# EAGLE schematic electronic system (EAGLE 9.2.2)
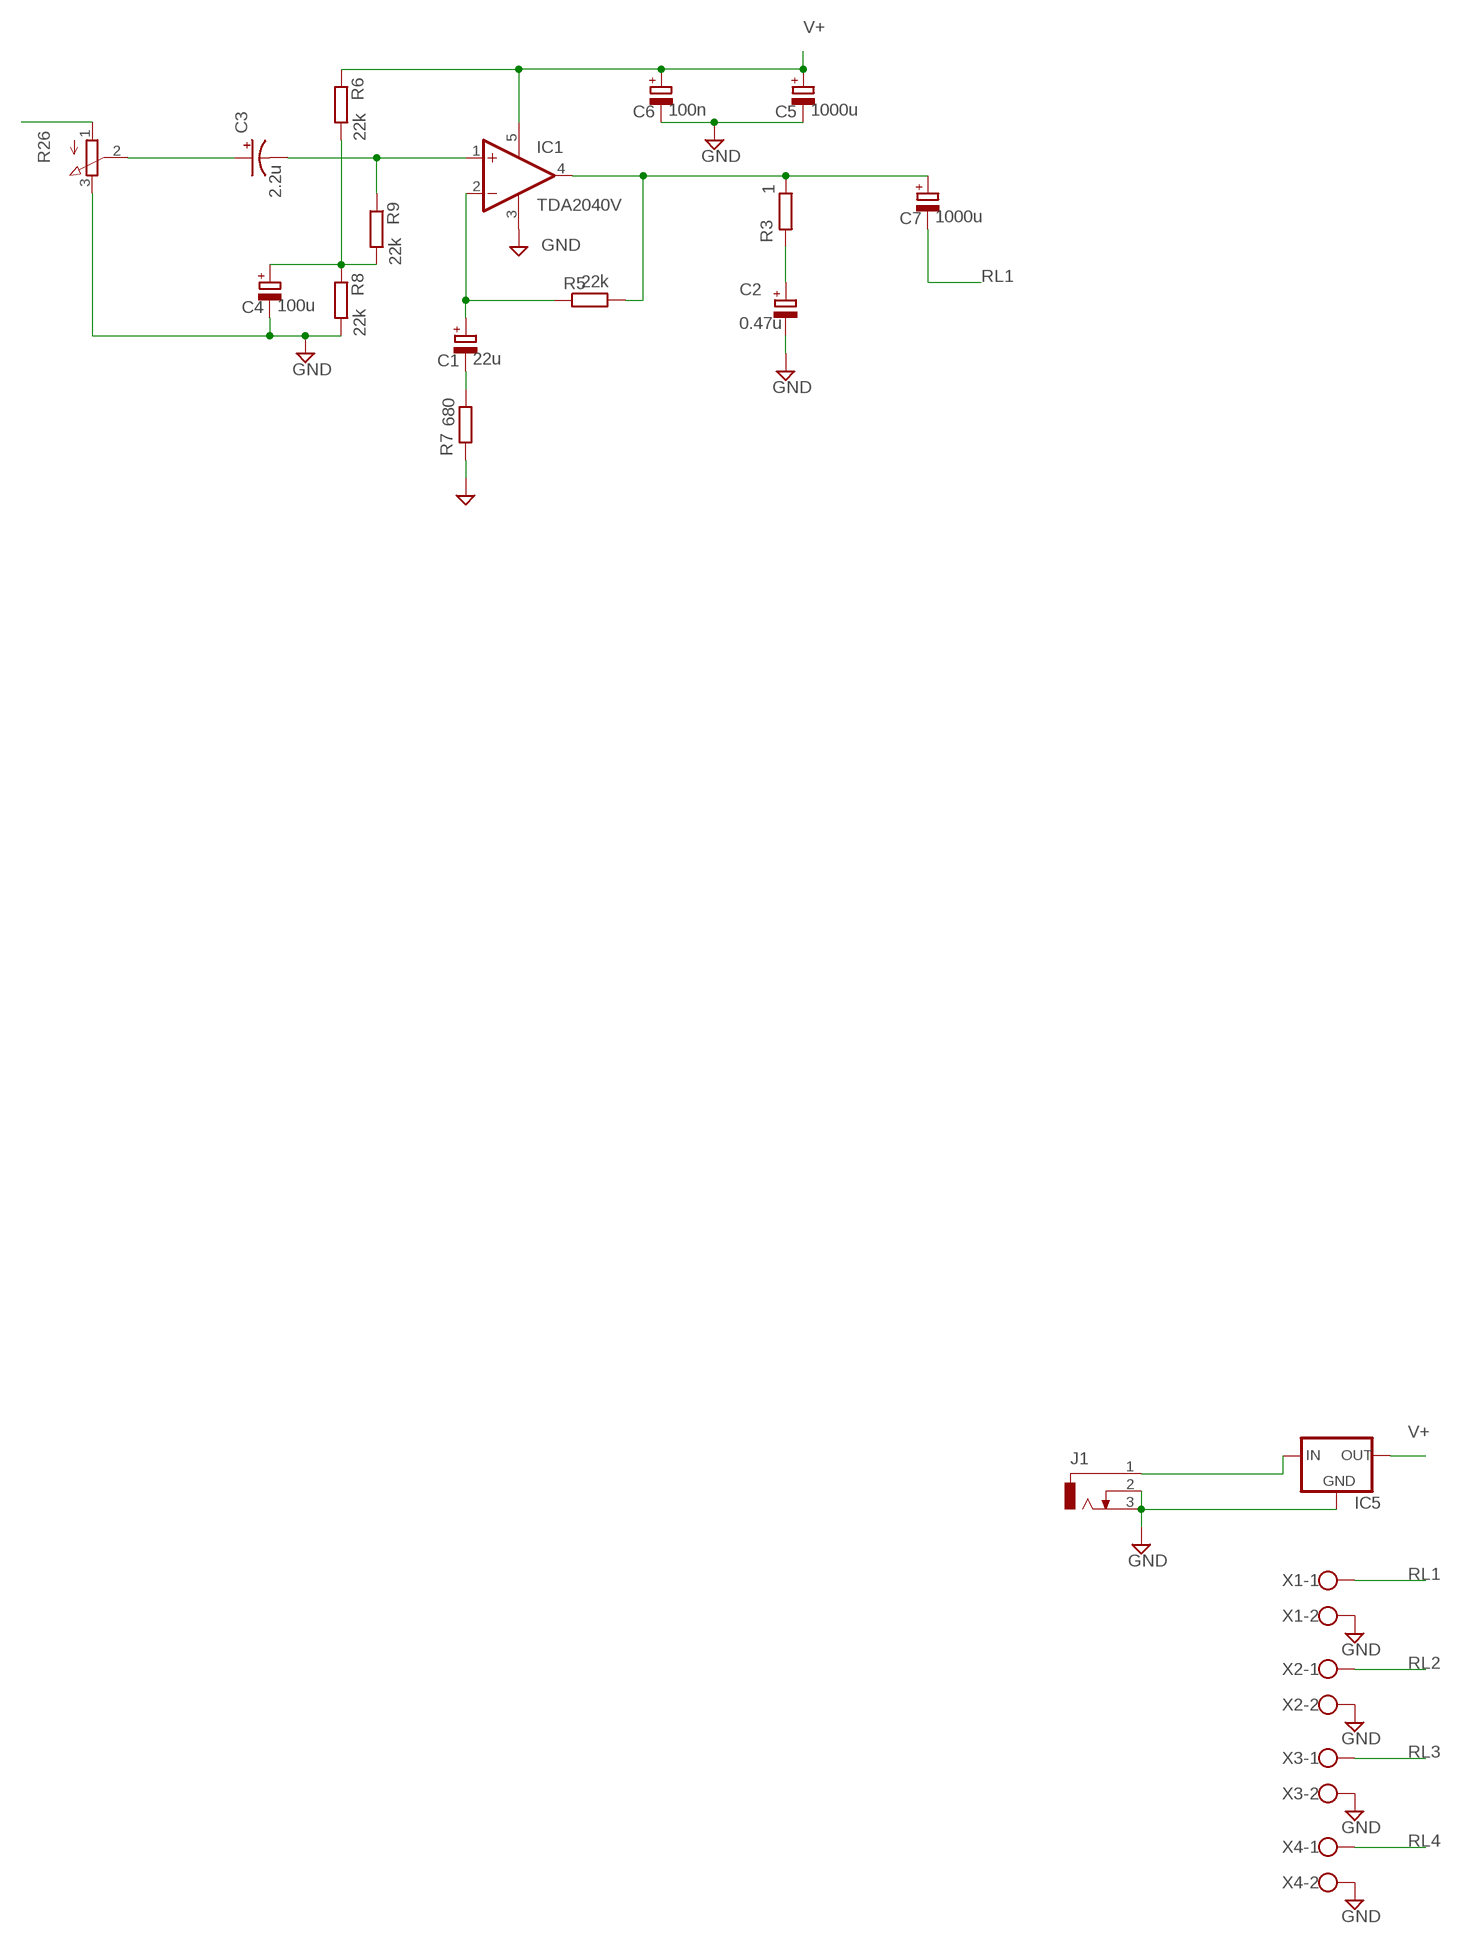
[diagram p0: schematic, sheet 1]

## Parts
C1  22u  CPOL-EUE5-6  [E5-6]
C2  0.47u  CPOL-EUE5-5  [E5-5]
C3  2.2u  CPOL-USTT5D11  [TT5D11]
C4  100u  CPOL-EUE5-10.5  [E5-10,5]
C5  1000u  CPOL-EUE5-10.5  [E5-10,5]
C6  100n  CPOL-EUE5-5  [E5-5]
C7  1000u  CPOL-EUE5-10.5  [E5-10,5]
IC1  TDA2040V  [CB360]
IC5  78XXS  [78XXS]
J1  DCJ0303  [DCJ0303]
R3  1  R-EU_0207/12  [0207/12]
R5  22k  R-EU_0207/12  [0207/12]
R6  22k  R-EU_0207/12  [0207/12]
R7  680  R-EU_0207/12  [0207/12]
R8  22k  R-EU_0207/12  [0207/12]
R9  22k  R-EU_0207/12  [0207/12]
R26  3RP/1610N  [3RP/1610N]
X1  W237-102  [W237-102]
X2  W237-102  [W237-102]
X3  W237-102  [W237-102]
X4  W237-102  [W237-102]

## Nets
GND: C2.- C4.- C5.- C6.- IC1.3(V-) IC5.GND J1.2 J1.3 R7.2 R8.2 R26.3(E) X1.2 X2.2 X3.2 X4.2
N$1: C7.+ IC1.4(OUT) R3.1 R5.2
N$2: C2.+ R3.2
N$3: C1.+ IC1.2(-IN) R5.1
N$4: C1.- R7.1
N$7: C3.- IC1.1(+IN) R9.1
N$9: C4.+ R6.2 R8.1 R9.2
N$26: IC5.IN J1.1
N$27: C3.+ R26.2(S)
N$29: R26.1(A)
RL1: C7.- X1.1
RL2: X2.1
RL3: X3.1
RL4: X4.1
V+: C5.+ C6.+ IC1.5(V+) IC5.OUT R6.1

## Library data of the parts
C1 C2 C4-C7 = rcl:CPOL-EU: POLARIZED CAPACITOR, European symbol; SPICEPREFIX: C
C3 = rcl:CPOL-US: POLARIZED CAPACITOR, American symbol; SPICEPREFIX: C
IC1 = Audio-Power-amlifier V.2.0:TDA2040: Power OP AMP
IC5 = v-reg:78XXS: VOLTAGE REGULATOR
J1 = con-jack:DCJ0303: DC POWER JACK Source: DCJ0303.pdf; OC_FARNELL: unknown; OC_NEWARK: unknown
R3 R5-R9 = rcl:R-EU_: RESISTOR, European symbol; SPICEPREFIX: R
R26 = pot:3RP/1610N: 16mm Potentiometer one level Source: http://www.alphapotentiometers.net/html/16mm_pot_2.html
X1-X4 = con-wago-500:W237-102: WAGO SCREW CLAMP; MPN: 237-102; OC_FARNELL: unknown; OC_NEWARK: 70K9898